# EAGLE design odin_mod (EAGLE 6.6.0)
Pulsar P3 Replacement Module 'Odin' made by Roy Schneider 2020
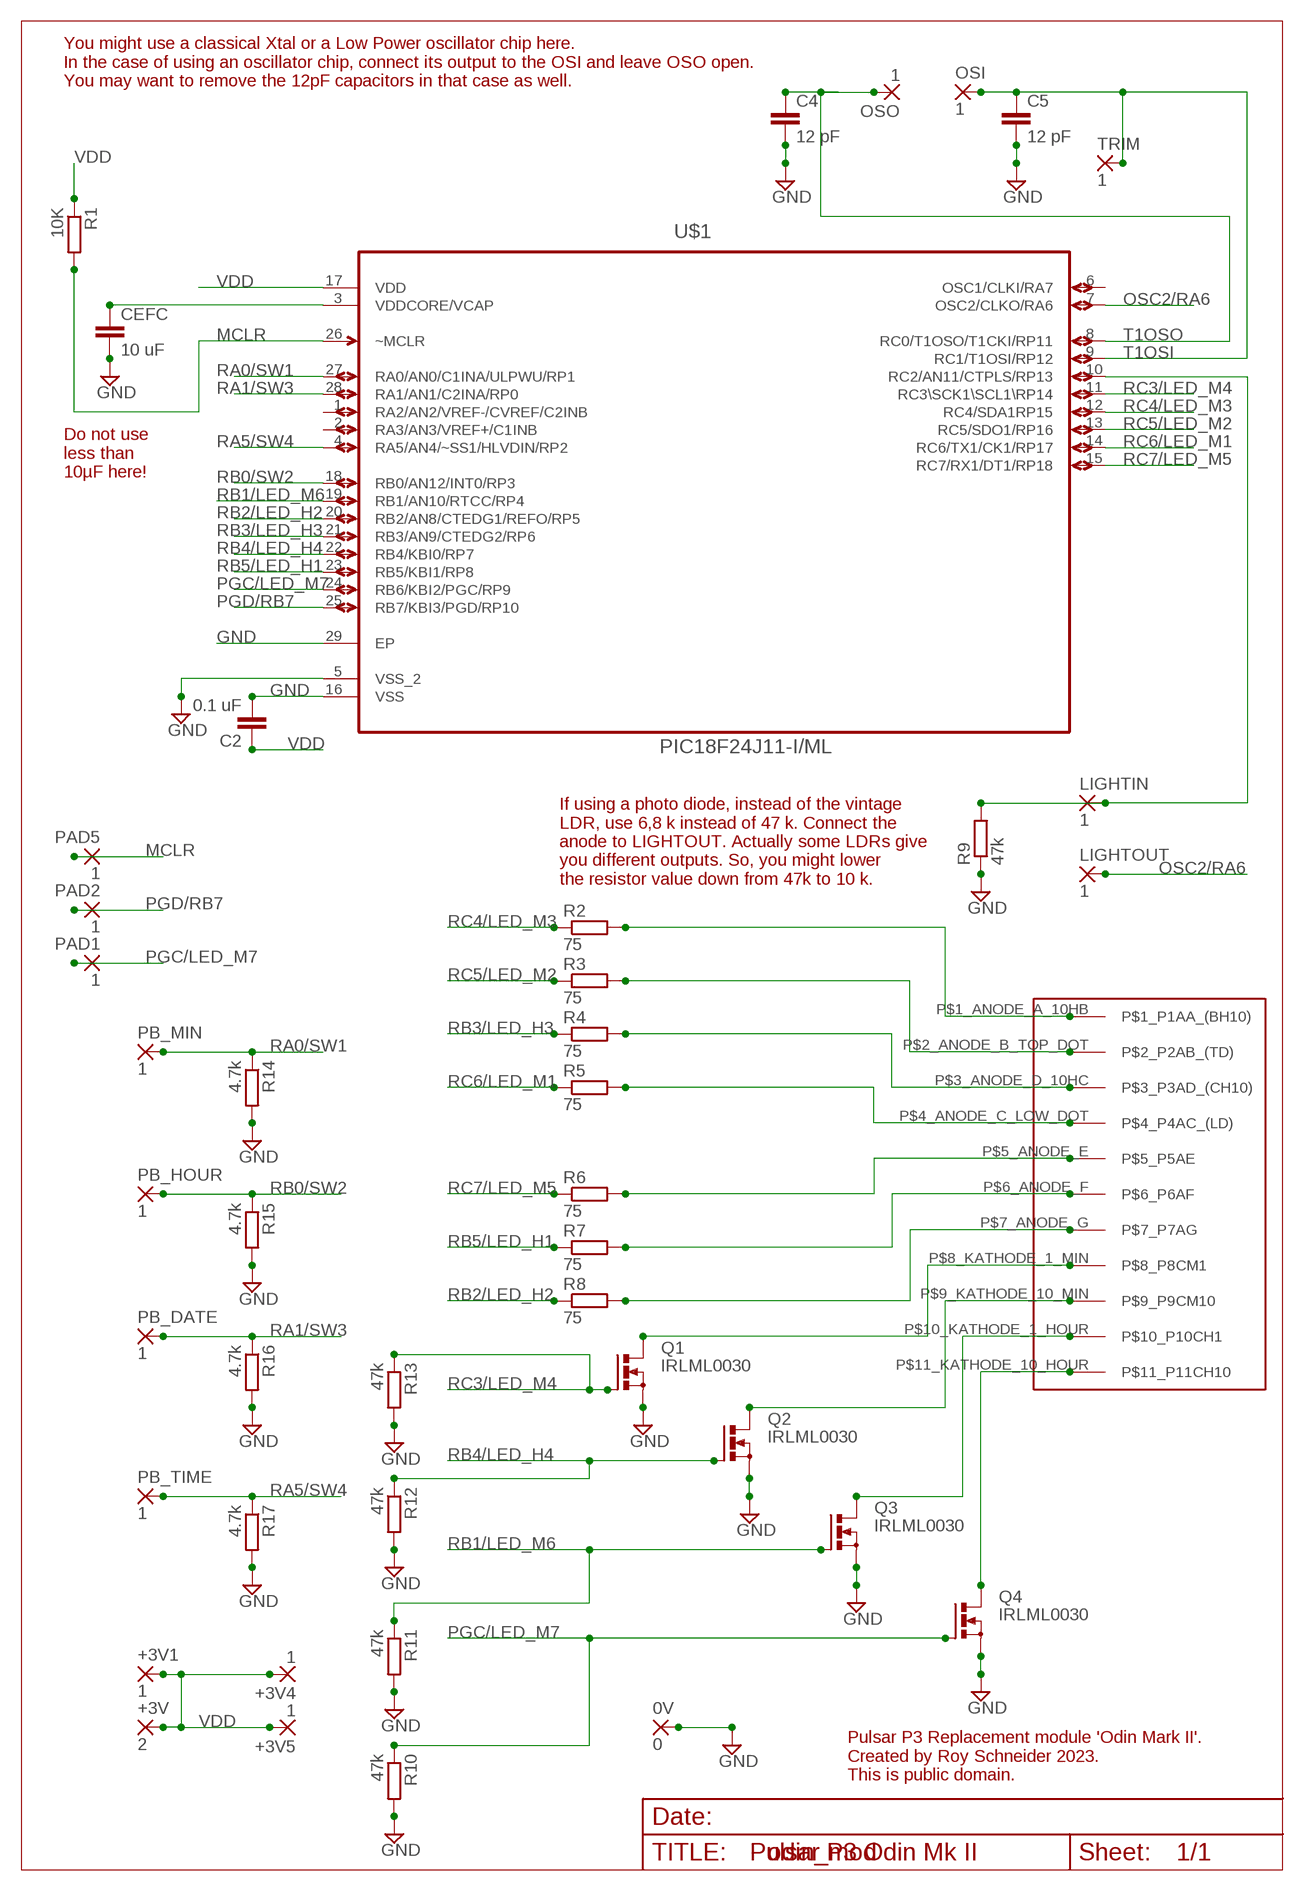
[diagram p0: schematic, sheet 1]

## Parts
0V  0  SMD2  [SMD1,27-2,54]
+3V  2  SMD2  [SMD1,27-2,54]
+3V1  1  SMD2  [SMD1,27-2,54]
+3V4  1  SMD2  [SMD1,27-2,54]
+3V5  1  SMD2  [SMD1,27-2,54]
C2  0.1 uF  C-EUC0603  [C0603]
C4  12 pF  C-EUC0603  [C0603]
C5  12 pF  C-EUC0603  [C0603]
CEFC  10 uF  C-EUC0603  [C0603]
LIGHTIN  1  SMD2  [SMD1,27-2,54]
LIGHTOUT  1  SMD2  [SMD1,27-2,54]
OSI  1  SMD2  [SMD1,27-2,54]
OSO  1  SMD2  [SMD1,27-2,54]
PAD1  1  SMD2  [SMD1,27-2,54]
PAD2  1  SMD2  [SMD1,27-2,54]
PAD5  1  SMD2  [SMD1,27-2,54]
PB_DATE  1  SMD2  [SMD1,27-2,54]
PB_HOUR  1  SMD2  [SMD1,27-2,54]
PB_MIN  1  SMD2  [SMD1,27-2,54]
PB_TIME  1  SMD2  [SMD1,27-2,54]
Q1  IRLML0030  [SOT-23]
Q2  IRLML0030  [SOT-23]
Q3  IRLML0030  [SOT-23]
Q4  IRLML0030  [SOT-23]
R1  10K  R-EU_R0402  [R0402]
R2  75  R-EU_R0402  [R0402]
R3  75  R-EU_R0402  [R0402]
R4  75  R-EU_R0402  [R0402]
R5  75  R-EU_R0402  [R0402]
R6  75  R-EU_R0402  [R0402]
R7  75  R-EU_R0402  [R0402]
R8  75  R-EU_R0402  [R0402]
R9  47k  R-EU_R0402  [R0402]
R10  47k  R-EU_R0402  [R0402]
R11  47k  R-EU_R0402  [R0402]
R12  47k  R-EU_R0402  [R0402]
R13  47k  R-EU_R0402  [R0402]
R14  4.7k  R-EU_R0402  [R0402]
R15  4.7k  R-EU_R0402  [R0402]
R16  4.7k  R-EU_R0402  [R0402]
R17  4.7k  R-EU_R0402  [R0402]
TRIM  1  SMD2  [SMD1,27-2,54]
U$1  PIC18F24J11-I/ML  [QFN65P600X600X100-29N]
U$3  PULSAR_P3_DISPLAY  [PULSAR_P3_LED_DISPLAY]

## Nets
GND: 0V.1(P) C2.2 C4.2 C5.2 CEFC.2 Q1.P2(S) Q2.P2(S) Q3.P2(S) Q4.P2(S) R9.1 R10.2 R11.2 R12.2 R13.2 R14.2 R15.2 R16.2 R17.2 U$1.5(VSS_2) U$1.16(VSS) U$1.29(EP)
MCLR: PAD5.1(P) R1.2 U$1.26(~MCLR)
N$1: LIGHTIN.1(P) R9.2 U$1.10(RC2/AN11/CTPLS/RP13)
N$2: R2.2 U$3.P$1_ANODE_A_10HB(P$1_P1AA_(BH10))
N$3: R3.2 U$3.P$2_ANODE_B_TOP_DOT(P$2_P2AB_(TD))
N$6: R4.2 U$3.P$3_ANODE_D_10HC(P$3_P3AD_(CH10))
N$7: R5.2 U$3.P$4_ANODE_C_LOW_DOT(P$4_P4AC_(LD))
N$8: R6.2 U$3.P$5_ANODE_E(P$5_P5AE)
N$9: R7.2 U$3.P$6_ANODE_F(P$6_P6AF)
N$10: R8.2 U$3.P$7_ANODE_G(P$7_P7AG)
N$11: Q4.P3(D) U$3.P$11_KATHODE_10_HOUR(P$11_P11CH10)
N$12: Q3.P3(D) U$3.P$10_KATHODE_1_HOUR(P$10_P10CH1)
N$13: Q2.P3(D) U$3.P$9_KATHODE_10_MIN(P$9_P9CM10)
N$14: Q1.P3(D) U$3.P$8_KATHODE_1_MIN(P$8_P8CM1)
OSC2/RA6: LIGHTOUT.1(P) U$1.7(OSC2/CLKO/RA6)
PGC/LED_M7: PAD1.1(P) Q4.P1(G) R10.1 U$1.24(RB6/KBI2/PGC/RP9)
PGD/RB7: PAD2.1(P) U$1.25(RB7/KBI3/PGD/RP10)
RA0/SW1: PB_MIN.1(P) R14.1 U$1.27(RA0/AN0/C1INA/ULPWU/RP1)
RA1/SW3: PB_DATE.1(P) R16.1 U$1.28(RA1/AN1/C2INA/RP0)
RA5/SW4: PB_TIME.1(P) R17.1 U$1.4(RA5/AN4/~SS1/HLVDIN/RP2)
RB0/SW2: PB_HOUR.1(P) R15.1 U$1.18(RB0/AN12/INT0/RP3)
RB1/LED_M6: Q3.P1(G) R11.1 U$1.19(RB1/AN10/RTCC/RP4)
RB2/LED_H2: R8.1 U$1.20(RB2/AN8/CTEDG1/REFO/RP5)
RB3/LED_H3: R4.1 U$1.21(RB3/AN9/CTEDG2/RP6)
RB4/LED_H4: Q2.P1(G) R12.1 U$1.22(RB4/KBI0/RP7)
RB5/LED_H1: R7.1 U$1.23(RB5/KBI1/RP8)
RC3/LED_M4: Q1.P1(G) R13.1 U$1.11(RC3\SCK1\SCL1\RP14)
RC4/LED_M3: R2.1 U$1.12(RC4/SDA1RP15)
RC5/LED_M2: R3.1 U$1.13(RC5/SDO1/RP16)
RC6/LED_M1: R5.1 U$1.14(RC6/TX1/CK1/RP17)
RC7/LED_M5: R6.1 U$1.15(RC7/RX1/DT1/RP18)
T1OSI: C5.1 OSI.1(P) TRIM.1(P) U$1.9(RC1/T1OSI/RP12)
T1OSO: C4.1 OSO.1(P) U$1.8(RC0/T1OSO/T1CKI/RP11)
VDD: +3V1.1(P) +3V4.1(P) +3V5.1(P) +3V.1(P) C2.1 R1.1 U$1.17(VDD)
VDDCORE/VCAP: CEFC.1 U$1.3(VDDCORE/VCAP)
Unconnected: U$1.1(RA2/AN2/VREF-/CVREF/C2INB) U$1.2(RA3/AN3/VREF+/C1INB) U$1.6(OSC1/CLKI/RA7)

## Notes on the sheet
- You might use a classical Xtal or a Low Power oscillator chip here.
  In the case of using an oscillator chip, connect its output to the OSI and leave OSO open.
  You may want to remove the 12pF capacitors in that case as well.
- Do not use
  less than
  10µF here!
- If using a photo diode, instead of the vintage
  LDR, use 6,8 k instead of 47 k. Connect the
  anode to LIGHTOUT. Actually some LDRs give
  you different outputs. So, you might lower
  the resistor value down from 47k to 10 k.
- Pulsar P3 Replacement module 'Odin Mark II'.
  Created by Roy Schneider 2023.
  This is public domain.
- Pulsar P3 Odin Mk II

## Library data of the parts
0V +3V +3V1 +3V4 +3V5 LIGHTIN LIGHTOUT OSI OSO PAD1 PAD2 PAD5 PB_DATE PB_HOUR PB_MIN PB_TIME TRIM = wirepad:SMD2: SMD PAD
C2 C4 C5 CEFC = resistor:C-EU: CAPACITOR, European symbol
Q1-Q4 = irlml0030:IRLML0030: Nch MOSFET IRLML0030 30 V, 5,3 A, Rds(on) 0,022 Ohm, SOT-23 https://www.mouser.de/datasheet/2/196/Infineon_IRLML0030_DataSheet_v01_01_EN-3166591.pdf
R1 = rcl:R-EU_: RESISTOR, European symbol
R2-R17 = resistor:R-EU_: RESISTOR, European symbol
U$1 = pic18f24j11:PIC18F24J11-I/ML: 8BIT MCU; DESCRIPTION: 8BIT MCU; MPN: PIC18F24J11-I/Ml; OC_FARNELL: 1707634; OC_NEWARK: 98M1764; PACKAGE: QFN-28; SUPPLIER: Microchip
U$3 = pulsar_p3_display:PULSAR_P3_DISPLAY: Vintage Pulsar P3 Display made by Litronix.

## Net classes
0 default: clearance 0.205 mm

## Board
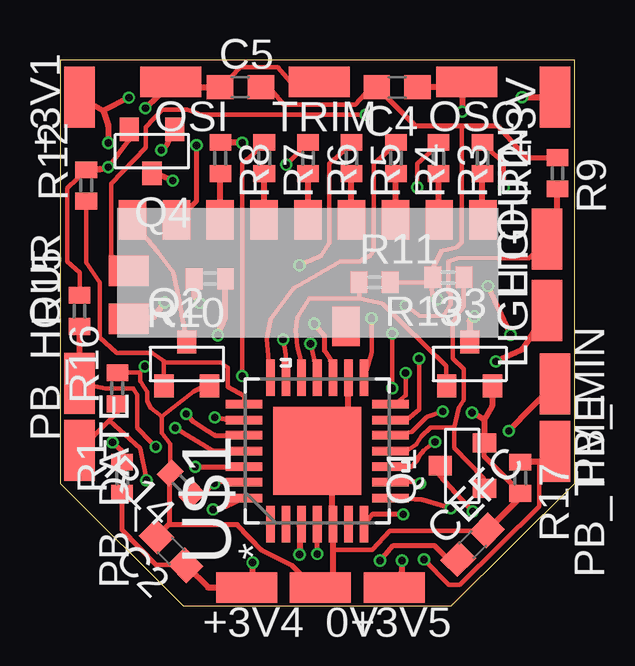
[diagram p1: board, top side]
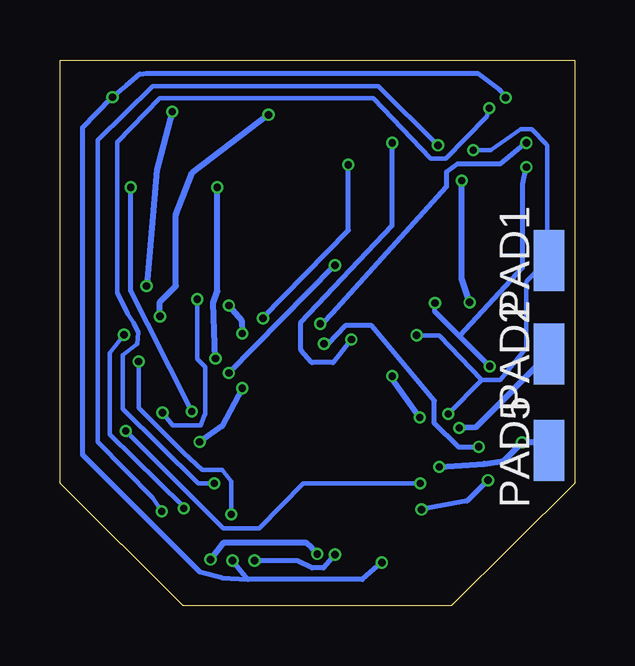
[diagram p2: board, bottom side, seen from below]

Size 21.44 x 22.76 mm. Coordinates in mm from the lower left corner, seen from the top.
Outline: 5.13,0 16.31,0 21.44,5.11 21.44,22.76 0,22.76 0,5.11 5.13,0
Copper layers (1*16): Top 0.035mm / dielectric 1.5mm / Bottom 0.035mm
Design rules "default *": minimum track width 6mil, minimum drill 12mil, track to track 4mil, track to pad 4mil, pad to pad 4mil, via to via 4mil, smd to smd 4mil, copper to edge 5mil, drill to drill 8mil, minimum pad ring 5mil, minimum via ring 4mil, stop-mask expansion 4mil, vias tented up to drill 0mil, thermal gap 5mil

### Footprints (pad centres in the part's own frame; a part is rotated, then mirrored left to right if it is on the bottom)
SMD1,27-2,54 = smd 1.27 x 2.54: 1 0,0
C0603 = smd 1.1 x 1: 1 -0.85,0; 2 0.85,0
SOT-23 = smd 0.802 x 0.972: P1 -0.95,-0.917; P2 0.95,-0.917; P3 0,0.917
R0402 = smd 0.7 x 0.9: 1 -0.65,0; 2 0.65,0
QFN65P600X600X100-29N = smd 1.524 x 0.356: 1 -3.048,1.956; 2 -3.048,1.295; 3 -3.048,0.66; 4 -3.048,0; 5 -3.048,-0.66; 6 -3.048,-1.295; 7 -3.048,-1.956; 15 3.048,-1.956; 16 3.048,-1.295; 17 3.048,-0.66; 18 3.048,0; 19 3.048,0.66; 20 3.048,1.295; 21 3.048,1.956 | smd 0.356 x 1.524: 8 -1.956,-3.048; 9 -1.295,-3.048; 10 -0.66,-3.048; 11 0,-3.048; 12 0.66,-3.048; 13 1.295,-3.048; 14 1.956,-3.048; 22 1.956,3.048; 23 1.295,3.048; 24 0.66,3.048; 25 0,3.048; 26 -0.66,3.048; 27 -1.295,3.048; 28 -1.956,3.048 | smd 3.658 x 3.658: 29 0,0
PULSAR_P3_LED_DISPLAY = smd 1.143 x 1.651: P$1_ANODE_A_10HB 15.24,4.921; P$2_ANODE_B_TOP_DOT 13.414,4.921; P$3_ANODE_D_10HC 11.589,4.921; P$4_ANODE_C_LOW_DOT 9.763,4.921; P$5_ANODE_E 7.938,4.921; P$6_ANODE_F 6.112,4.921; P$7_ANODE_G 4.286,4.921; P$8_KATHODE_1_MIN 2.461,4.921; P$9_KATHODE_10_MIN 0.635,4.921; P$12 9.525,0.476 | smd 1.651 x 1.27: P$10_KATHODE_1_HOUR 0.476,2.8; P$11_KATHODE_10_HOUR 0.476,0.787

### Placement (x,y rotation side)
0V  10.85,0.76 90 top
+3V  20.62,21.21 0 top
+3V1  0.81,21.21 0 top
+3V4  7.77,0.76 90 top
+3V5  13.92,0.76 90 top
C2  4.62,2.29 135 top
C4  14.05,21.62 180 top
C5  7.52,21.62 0 top
CEFC  17.2,2.54 45 top
LIGHTIN  20.29,15.29 0 top
LIGHTOUT  20.29,12.32 0 top
OSI  4.62,21.84 90 top
OSO  16.94,21.84 90 top
PAD1  1.07,14.4 0 bottom
PAD2  1.07,10.49 0 bottom
PAD5  1.07,6.48 0 bottom
PB_DATE  0.81,6.48 180 top
PB_HOUR  0.81,9.27 0 top
PB_MIN  20.62,9.25 180 top
PB_TIME  20.62,6.43 180 top
Q1  16.76,5.84 90 top
Q2  5.28,10.08 0 top
Q3  17.07,10.08 0 top
Q4  3.84,18.95 180 top
R1  2.59,5.33 90 top
R2  17.6,18.67 270 top
R3  15.77,18.67 270 top
R4  14,18.67 270 top
R5  12.14,18.67 270 top
R6  10.34,18.67 270 top
R7  8.51,18.67 270 top
R8  6.68,18.67 270 top
R9  20.73,18.03 270 top
R10  6.25,13.64 180 top
R11  13.11,13.49 0 top
R12  1.09,17.53 90 top
R13  16.18,13.69 180 top
R14  5.05,5.08 135 top
R15  0.81,12.29 90 top
R16  2.39,9.07 90 top
R17  19.18,5.33 270 top
TRIM  10.79,21.84 90 top
U$1  10.72,6.45 90 top
U$3  2.39,11.18 0 top

### Tracks (layer width: path | path; a pad name or v marks a point on that pad's centre or on a via)
GND  (via drill 0.3)
  Top 0.152: 1.09,18.16 R12.2 | 4.57,5.54 R14.2 | 4.04,2.9 C2.2 | 6.17,9.22 6.22,9.22 Q2.P2 | 5.61,13.61 R10.2 | 15.52,13.69 R13.2 | 20.73,18.69 R9.1 | C4.2 | 15.57,13.74 R13.2 | 17.68,6.81 Q1.P2 17.68,6.73 | 18.01,9.25 Q3.P2 | 19.15,4.75 R17.2 | 11.33,3.45 U$1.5 | 17.73,3.12 CEFC.2 | 15.47,13.61 R13.2 | 10.79,0.81 0V.1
  Top 0.178: R15.2 0.81,13.89 0.3,14.35 0.3,17.42 1.09,18.16 | 2.87,19.41 2.87,19.86 2.9,19.86 Q4.P2 | 6.17,9.22 5.56,8.94 4.24,7.9 | 4.24,7.9 4.24,7.21 4.6,6.76 4.6,5.69 R14.2 | v2.01,18.29 2.03,18.29 | R11.2 15.21,13.49 15.52,13.69 | C5.2 8.71,21.61 9.32,20.9 12.29,20.9 12.93,21.59 13.13,21.59 C4.2 | 15.57,13.74 15.57,14.15 15.87,14.78 16.51,14.94 16.74,15.16 16.74,20.02 | 19.18,4.52 R17.2 | 0V.1 11.38,1.29 | 17.73,3.12 13.74,3.12 13,2.34 11.38,2.34 | 15.47,13.61 15.52,12.98 v15.72,12.78 | 10.79,0.81 10.54,0.81 | 4.24,7.9 3.78,8.26 3.63,8.53 3.63,8.91 3.35,9.37 3.35,9.73 | 3.35,9.73 R16.2 | v3.53,9.98 3.35,9.73 | R12.2 1.14,18.21
  Top 0.203: 2.03,18.29 2.87,19.41 | 4.57,3.43 4.57,5.54 | 4.04,2.9 4.57,3.43 | 20.73,18.69 19.43,18.69 18.21,20.02 16.74,20.02 14.81,20.02 C4.2 | 17.68,6.73 17.68,6.22 19.15,4.75 | U$1.29 12.01,7.75 | 10.54,0.81 9.65,1.68 8.41,2.31 7.39,3.38 4.62,3.38 4.57,3.43
  Top 0.254: 2.03,18.29 1.68,18.21 1.14,18.21 | 5.61,13.61 5.61,12.9 v5.82,12.62 | 17.68,7.75 18.01,8.33 18.01,9.25 | 17.68,7.75 17.68,6.81 | CEFC.2 19.18,4.52 | 11.38,1.29 11.38,2.34 U$1.5 | 12.01,7.75 U$1.16 | 11.33,6.96 11.33,3.45 | 17.68,7.75 v17.17,8.05
  Top 2.032: 11.33,6.96 U$1.29
  Bottom 0.178: v15.72,12.78 15.72,10.29 15.39,9.96 15.39,8 15.44,7.87 15.57,7.52 16.74,7.52 v17.17,8.05
  Bottom 0.203: v5.82,12.62 5.82,12.27 4.8,11.25 | v3.53,9.98 4.8,11.25 | 4.8,11.25 2.18,14.1 2.16,14.1 2.16,17.58 v2.01,18.29
MCLR  (via drill 0.3)
  Top 0.203: R1.2 2.57,6.48 v2.18,6.81 | v5.64,5.79 U$1.26
  Bottom 0.178: 1.4,6.81 PAD5.1 1.45,6.81
  Bottom 0.254: 1.45,6.81 v2.18,6.81 2.95,6.04 3.76,5.92 v5.64,5.79
N$1  (via drill 0.3)
  Top 0.178: 20.73,15.67 LIGHTIN.1 19.56,14.5 16.61,14.5 16.18,14.35 16.18,13.13 16.28,13.01 16.28,12.57 15.98,12.09 14.99,12.09 v14.4,12.52 | v13.84,11.35 v13.84,9.07 | v15.62,6.83 15.16,6.48 14.96,6.25 14.83,6.02 14.63,5.79 U$1.10
  Top 0.254: 20.73,15.67 R9.2
  Bottom 0.254: v15.62,6.83 14.68,7.49 v13.84,9.07 | v13.84,11.35 13.87,11.89 v14.4,12.52
N$2
  Top 0.152: 17.6,16.08 17.63,16.05 U$3.P$1_ANODE_A_10HB
  Top 0.254: 17.6,16.08 R2.2
N$3
  Top 0.152: 15.77,16.08 15.8,16.05 U$3.P$2_ANODE_B_TOP_DOT
  Top 0.254: 15.77,16.08 R3.2
N$6
  Top 0.152: 14,16.05 U$3.P$3_ANODE_D_10HC
  Top 0.254: 14,16.05 R4.2
N$7
  Top 0.152: 12.14,16.05 U$3.P$4_ANODE_C_LOW_DOT
  Top 0.254: 12.14,16.05 R5.2
N$8
  Top 0.152: 10.34,16.05 U$3.P$5_ANODE_E
  Top 0.254: 10.34,16.05 R6.2
N$9
  Top 0.152: 8.51,16.05 U$3.P$6_ANODE_F
  Top 0.254: 8.51,16.05 R7.2
N$10
  Top 0.152: 6.68,16.05 U$3.P$7_ANODE_G
  Top 0.254: 6.68,16.05 R8.2
N$11  (via drill 0.3)
  Top 0.152: 2.87,11.91 U$3.P$11_KATHODE_10_HOUR
  Top 0.254: v4.7,17.73 4.04,18.01 3.84,18.01 Q4.P3 | v4.37,12.65 3.91,12.04 2.87,11.91
  Bottom 0.254: v4.7,17.73 4.7,13.64 v4.37,12.65
N$12  (via drill 0.3)
  Top 0.178: v12.75,20.47 5.89,20.47 5.31,20.68 4.27,20.68 3.58,19.96 3.58,19.1 2.13,17.6 2.13,14.63 U$3.P$10_KATHODE_1_HOUR
  Top 0.254: Q3.P3 17.07,11.89 v17.27,12.06
  Bottom 0.254: v12.75,20.47 15.93,18.06 16.61,16.28 16.61,13.34 17.27,12.68 v17.27,12.06
N$13
  Top 0.152: 3.02,16.03 U$3.P$9_KATHODE_10_MIN
  Top 0.178: Q2.P3 4.93,12.93 4.72,13.89 4.11,14.71 3.02,16.03
N$14  (via drill 0.3)
  Top 0.152: 15.82,5.84 Q1.P3 | 4.85,16.05 U$3.P$8_KATHODE_1_MIN
  Top 0.203: 15.82,5.84 15.82,5.44 v17.2,3.94 | v5.69,19.2 5.69,16.89 4.85,16.05
  Bottom 0.178: v17.2,3.94 17.58,4.5 19.86,6.83 19.86,19.41 17.58,21.67 8.18,21.67 v5.69,19.2
OSC2/RA6  (via drill 0.3)
  Top 0.203: U$1.7 13,3.81 v14.3,3.81
  Top 0.254: v18.16,10.19 19.25,10.69 LIGHTOUT.1
  Bottom 0.178: v18.16,10.19 18.16,8.26 16.28,6.38 15.52,5.66 14.68,5.66 14.3,5.18 v14.3,3.81
PGC/LED_M7  (via drill 0.3)
  Top 0.152: 6.88,13.61 R10.1 | Q4.P1
  Top 0.203: Q4.P1 4.47,19.23 v4.22,19 | U$1.24 6.45,7.11 5.51,7.7 v5.26,8
  Top 0.254: 6.88,13.61 6.88,12.04 v6.58,11.28
  Bottom 0.178: v6.58,11.28 5.64,11.28 3.86,9.42 | 3.86,9.42 3.1,9.42 2.01,10.74 2.01,13.46 1.98,13.54 1.14,14.38 PAD1.1 1.14,14.48 1.14,19.18 1.17,19.25 1.78,19.86 2.23,19.86 3.48,19 v4.22,19 | 3.86,9.42 v5.26,8
PGD/RB7  (via drill 0.3)
  Top 0.203: U$1.25 6.38,6.45 v4.8,7.42
  Bottom 0.254: v4.8,7.42 4.11,7.44 PAD2.1
RA0/SW1  (via drill 0.3)
  Top 0.152: 5.54,4.62 R14.1 | v6.43,5.11 6.41,5.12
  Top 0.178: 5.92,4.62 5.54,4.62
  Top 0.203: 5.92,4.62 6.41,5.12 6.45,5.16 U$1.27
  Top 0.254: PB_MIN.1 v18.69,7.29
  Bottom 0.178: v6.43,5.11 11.3,5.11 13.13,3.23 14.63,3.23 v18.69,7.29
RA1/SW3  (via drill 0.3)
  Top 0.178: R16.1 2.62,8.28 2.06,7.72 | PB_DATE.1 2.06,7.72 | U$1.28 6.88,4.12 v6.38,4.01 | v3.61,5.23 3.35,6.55 2.06,7.72
  Bottom 0.203: v6.38,4.01 4.47,4.37 v3.61,5.23
RA5/SW4  (via drill 0.3)
  Top 0.178: PB_TIME.1 20.14,5.99 19.96,5.99 19.96,4.14 16.66,0.86 16.2,0.86 v15.16,1.93 | 19.18,5.99 R17.1
  Top 0.203: v10.72,2.16 U$1.4
  Top 0.254: 19.96,5.99 19.18,5.99
  Bottom 0.254: v10.72,2.16 10.95,2.41 11.2,2.64 14.6,2.64 v15.16,1.93
RB0/SW2  (via drill 0.3)
  Top 0.152: PB_HOUR.1 0.81,9.35
  Top 0.178: PB_HOUR.1 1.88,9.07 3.05,9.07 3.23,8.79 3.23,7.42 3.78,6.83 v3.99,6.63 | v10.44,10.92 10.67,9.88 U$1.18
  Top 0.254: 0.81,9.35 R15.1
  Bottom 0.203: v10.44,10.92 10.29,10.92 9.55,11.68 8.46,11.68 5.84,8.56 5.84,7.59 4.85,6.63 v3.99,6.63
RB1/LED_M6
  Top 0.152: 16.1,9.27 Q3.P1
  Top 0.178: U$1.19 10.06,10.19 9.88,10.82 9.83,11.51 9.88,12.01 10.39,12.8 12.47,12.8 | 16.1,9.27 16.1,10.01 13.44,12.6 12.47,12.8 | 12.47,12.8 R11.1
RB2/LED_H2  (via drill 0.3)
  Top 0.152: 6.68,19.3 R8.1
  Top 0.178: v9.3,11.1 9.4,10.49 9.42,10.21 U$1.20
  Top 0.254: v7.59,19.3 6.68,19.3
  Bottom 0.203: v7.59,19.3 7.59,15.85 11.4,11.81 11.4,10.67 10.95,10.13 10.06,10.13 v9.3,11.1
RB3/LED_H3
  Top 0.152: 14,19.23 R4.1
  Top 0.178: 14,19.23 13.08,18.44 13.08,14.81 12.93,14.61 12.47,14.35 11.68,14.35 9.73,13.23 8.79,11.96 8.61,11.12 U$1.21
RB4/LED_H4
  Top 0.178: R12.1 1.09,14.3 1.65,13.49 1.65,11.18 2.36,10.54 3.84,10.54 4.32,10.21 4.32,10.13 | 4.32,10.13 4.32,9.25 Q2.P1 | U$1.22 7.67,8.74 6.98,9.12 6.98,9.93 6.71,10.13 4.32,10.13
RB5/LED_H1  (via drill 0.3)
  Top 0.152: 8.51,19.23 R7.1
  Top 0.178: 8.51,19.23 7.59,18.44 v7.59,9.58
  Top 0.203: v6.45,7.85 6.96,7.75 U$1.23
  Bottom 0.254: v7.59,9.58 7.59,9.45 v6.45,7.85
RC3/LED_M4
  Top 0.152: 16.81,13.69 R13.1
  Top 0.178: 16.81,13.69 16.81,12.47 16.36,11.84 16.36,10.31 16.81,9.88 16.81,8.59 16.61,8.26 16.43,7.44 | 16.43,7.44 16.43,6.58 17.65,5.31 17.65,4.9 Q1.P1 | U$1.11 14.45,6.45 14.83,6.73 15.06,7.06 15.44,7.44 16.43,7.44
RC4/LED_M3  (via drill 0.3)
  Top 0.152: 17.6,19.23 R2.1
  Top 0.178: 17.6,19.23 18.49,18.49 v18.49,17.45 | v15.95,8.1 15.29,7.87 14.66,7.24 U$1.12
  Bottom 0.203: v18.49,17.45 18.49,13.13 17.78,11.73 v15.95,8.1
RC5/LED_M2  (via drill 0.3)
  Top 0.152: 15.77,19.23 R3.1
  Top 0.178: 15.77,19.23 14.88,18.44 v14.88,17.45 | v14.96,10.31 14.96,8.18 14.45,7.75 U$1.13
  Bottom 0.254: v14.88,17.45 14.88,13.11 15.06,12.62 v14.96,10.31
RC6/LED_M1  (via drill 0.3)
  Top 0.152: 12.14,19.23 R5.1
  Top 0.178: 12.14,19.23 11.23,18.44 11.23,15.11 10.87,14.58 v9.98,14.2 | v14.4,9.7 14.4,8.76 13.94,8.41 U$1.14
  Bottom 0.203: v14.4,9.7 v9.98,14.2
RC7/LED_M5  (via drill 0.3)
  Top 0.152: 10.34,19.3 R6.1
  Top 0.178: v9.42,18.39 10.34,19.3 | v12.98,11.99 12.98,10.57 U$1.15
  Bottom 0.203: v9.42,18.39 9.42,15.65 v12.98,11.99
T1OSI  (via drill 0.3)
  Top 0.152: 4.62,21.77 OSI.1 | 6.73,21.64 C5.1
  Top 0.178: OSI.1 4.85,21.61 | TRIM.1 9.6,21.84 9.07,22.45 7.52,22.45 6.73,21.64
  Top 0.203: U$1.9 14.96,5.16 v15.01,5.11
  Top 0.254: 4.85,21.61 C5.1 | 4.62,21.77 v3.56,20.75
  Bottom 0.178: v15.01,5.11 15.67,5.11 18.82,8.2 18.82,10.46 18.21,10.92 18.18,11.38 18.36,11.79 18.62,12.17 19.05,13.06 19.05,19.33 17.27,21.16 8.38,21.16 5.99,18.64 5.36,18.64 3.66,20.4 v3.56,20.75
T1OSO  (via drill 0.3)
  Top 0.178: OSO.1 16.66,21.61 16.76,21.57
  Top 0.203: U$1.8 15.09,4.42 v16.28,4.06 | v17.83,13.34 v18.77,11.3
  Top 0.254: 16.71,21.61 16.66,21.61 C4.1 | 16.76,21.57 v16.76,20.6
  Bottom 0.178: v16.28,4.06 16.31,4.14 19.35,7.14 19.35,10.54 v18.77,11.3
  Bottom 0.254: v17.83,13.34 17.4,18.16 v16.76,20.6
VDD  (via drill 0.3)
  Top 0.152: 5.21,1.7 C2.1 5.28,1.65
  Top 0.203: R1.1 2.59,3.17 4.04,1.68 5.21,1.7 | U$1.17 11.28,10.26 11.02,10.64 11.02,11.25 v10.59,11.76
  Top 0.254: v2.01,19.3 2.01,20.02 1.8,20.65 | +3V1.1 1.8,20.65 | 5.28,1.65 6.17,0.76 +3V4.1 8.03,1.17 v8.03,1.8 | +3V5.1 14.25,1.42 v14.25,1.88 | v19.25,21.21 +3V.1 | v2.87,21.18 1.8,20.65
  Bottom 0.178: 18.67,21.69 v19.25,21.21 19.3,21.16
  Bottom 0.203: v2.01,19.3 3.1,18.41 4.88,18.41 5.33,18.09 5.33,17.48 10.11,12.19 10.46,11.81 v10.59,11.76 | 13.61,1.09 v14.25,1.88 | 13.61,1.09 8.84,1.09 v8.03,1.8 | 13.61,1.09 14.71,1.17 15.6,1.4 20.5,6.3 20.5,19.94 19.3,21.16 | v2.87,21.18 3.12,21.51 4.04,22.2 17.83,22.2 18.11,22.17 18.67,21.69
VDDCORE/VCAP  (via drill 0.3)
  Top 0.178: 16.15,1.96 16.59,1.96 CEFC.1 | U$1.3 9.98,3.33
  Top 0.203: 16.15,1.96 15.6,2.52 13.89,2.52 v13.33,1.88
  Top 0.254: 9.98,3.33 v9.98,2.13
  Bottom 0.203: v13.33,1.88 11.56,1.88 10.95,1.57 10.46,1.57 v9.98,2.13